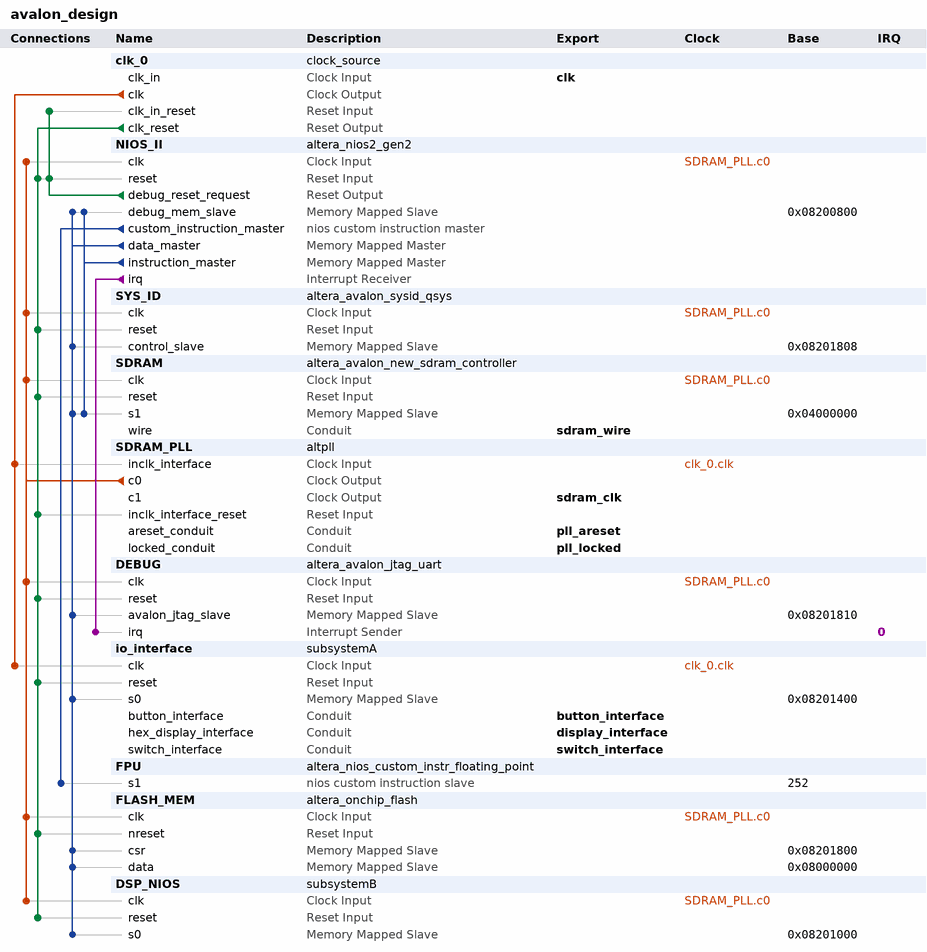
[diagram p0: system contents]
# Platform Designer (Qsys) system avalon_design, MAX 10 10M50DAF484C7G
# Parameters at their usual value, and those the tool derives, are not listed.
package require -exact qsys 18.1
create_system avalon_design
set_project_property DEVICE_FAMILY {MAX 10}
set_project_property DEVICE 10M50DAF484C7G

add_instance clk_0 clock_source 18.1
set_instance_parameter_value clk_0 clockFrequency 50000000

add_instance NIOS_II altera_nios2_gen2 18.1
set_instance_parameter_value NIOS_II dcache_size 2048
set_instance_parameter_value NIOS_II exceptionSlave SDRAM.s1
set_instance_parameter_value NIOS_II icache_size 4096
set_instance_parameter_value NIOS_II impl Fast
set_instance_parameter_value NIOS_II resetSlave SDRAM.s1

add_instance SYS_ID altera_avalon_sysid_qsys 18.1
set_instance_parameter_value SYS_ID id 0

add_instance SDRAM altera_avalon_new_sdram_controller 18.1
set_instance_parameter_value SDRAM TAC 5.5
set_instance_parameter_value SDRAM TRCD 20.0
set_instance_parameter_value SDRAM TRP 20.0
set_instance_parameter_value SDRAM casLatency 3
set_instance_parameter_value SDRAM columnWidth 10
set_instance_parameter_value SDRAM dataWidth 16
set_instance_parameter_value SDRAM generateSimulationModel false
set_instance_parameter_value SDRAM model single_Micron_MT48LC4M32B2_7_chip
set_instance_parameter_value SDRAM numberOfBanks 4
set_instance_parameter_value SDRAM numberOfChipSelects 1
set_instance_parameter_value SDRAM powerUpDelay 100.0
set_instance_parameter_value SDRAM refreshPeriod 15.625
set_instance_parameter_value SDRAM rowWidth 13

add_instance SDRAM_PLL altpll 18.1
set_instance_parameter_value SDRAM_PLL CLK0_DIVIDE_BY 1
set_instance_parameter_value SDRAM_PLL CLK0_MULTIPLY_BY 1
set_instance_parameter_value SDRAM_PLL CLK1_DIVIDE_BY 1
set_instance_parameter_value SDRAM_PLL CLK1_DUTY_CYCLE 50
set_instance_parameter_value SDRAM_PLL CLK1_MULTIPLY_BY 1
set_instance_parameter_value SDRAM_PLL CLK1_PHASE_SHIFT -3000
set_instance_parameter_value SDRAM_PLL INCLK0_INPUT_FREQUENCY 20000
set_instance_parameter_value SDRAM_PLL PORT_ARESET PORT_USED
set_instance_parameter_value SDRAM_PLL PORT_LOCKED PORT_USED
set_instance_parameter_value SDRAM_PLL PORT_clk1 PORT_USED
set_instance_parameter_value SDRAM_PLL PORT_clk2 PORT_UNUSED
set_instance_parameter_value SDRAM_PLL PORT_clk3 PORT_UNUSED

add_instance DEBUG altera_avalon_jtag_uart 18.1
set_instance_parameter_value DEBUG simInteractiveOptions NO_INTERACTIVE_WINDOWS

add_instance io_interface subsystemA 1.0

add_instance FPU altera_nios_custom_instr_floating_point 18.1
set_instance_parameter_value FPU useDivider 0

add_instance FLASH_MEM altera_onchip_flash 18.1
set_instance_parameter_value FLASH_MEM CLOCK_FREQUENCY 50.0
set_instance_parameter_value FLASH_MEM CONFIGURATION_MODE {Single Uncompressed Image with Memory Initialization}
set_instance_parameter_value FLASH_MEM SECTOR_ACCESS_MODE {Read and write,Read and write,Read and write,Read and write,Read and write}
set_instance_parameter_value FLASH_MEM initFlashContent false
set_instance_parameter_value FLASH_MEM initializationFileName altera_onchip_flash.hex
set_instance_parameter_value FLASH_MEM useNonDefaultInitFile false

add_instance DSP_NIOS subsystemB 1.0

# connections
add_connection clk_0.clk io_interface.clk clock
add_connection clk_0.clk SDRAM_PLL.inclk_interface clock
add_connection SDRAM_PLL.c0 DEBUG.clk clock
add_connection SDRAM_PLL.c0 DSP_NIOS.clk clock
add_connection SDRAM_PLL.c0 FLASH_MEM.clk clock
add_connection SDRAM_PLL.c0 NIOS_II.clk clock
add_connection SDRAM_PLL.c0 SDRAM.clk clock
add_connection SDRAM_PLL.c0 SYS_ID.clk clock
add_connection clk_0.clk_reset DEBUG.reset reset
add_connection clk_0.clk_reset DSP_NIOS.reset reset
add_connection clk_0.clk_reset FLASH_MEM.nreset reset
add_connection clk_0.clk_reset io_interface.reset reset
add_connection clk_0.clk_reset NIOS_II.reset reset
add_connection clk_0.clk_reset SDRAM.reset reset
add_connection clk_0.clk_reset SDRAM_PLL.inclk_interface_reset reset
add_connection clk_0.clk_reset SYS_ID.reset reset
add_connection NIOS_II.debug_reset_request clk_0.clk_in_reset reset
add_connection NIOS_II.debug_reset_request NIOS_II.reset reset
add_connection NIOS_II.data_master DEBUG.avalon_jtag_slave avalon
set_connection_parameter_value NIOS_II.data_master/DEBUG.avalon_jtag_slave baseAddress 0x08201810
add_connection NIOS_II.data_master DSP_NIOS.s0 avalon
set_connection_parameter_value NIOS_II.data_master/DSP_NIOS.s0 baseAddress 0x08201000
add_connection NIOS_II.data_master FLASH_MEM.csr avalon
set_connection_parameter_value NIOS_II.data_master/FLASH_MEM.csr baseAddress 0x08201800
add_connection NIOS_II.data_master FLASH_MEM.data avalon
set_connection_parameter_value NIOS_II.data_master/FLASH_MEM.data baseAddress 0x08000000
add_connection NIOS_II.data_master io_interface.s0 avalon
set_connection_parameter_value NIOS_II.data_master/io_interface.s0 baseAddress 0x08201400
add_connection NIOS_II.data_master NIOS_II.debug_mem_slave avalon
set_connection_parameter_value NIOS_II.data_master/NIOS_II.debug_mem_slave baseAddress 0x08200800
add_connection NIOS_II.data_master SDRAM.s1 avalon
set_connection_parameter_value NIOS_II.data_master/SDRAM.s1 baseAddress 0x04000000
add_connection NIOS_II.data_master SYS_ID.control_slave avalon
set_connection_parameter_value NIOS_II.data_master/SYS_ID.control_slave baseAddress 0x08201808
add_connection NIOS_II.instruction_master NIOS_II.debug_mem_slave avalon
set_connection_parameter_value NIOS_II.instruction_master/NIOS_II.debug_mem_slave baseAddress 0x08200800
add_connection NIOS_II.instruction_master SDRAM.s1 avalon
set_connection_parameter_value NIOS_II.instruction_master/SDRAM.s1 baseAddress 0x04000000
add_connection NIOS_II.irq DEBUG.irq interrupt
set_connection_parameter_value NIOS_II.irq/DEBUG.irq irqNumber 0
add_connection NIOS_II.custom_instruction_master FPU.s1 nios_custom_instruction
set_connection_parameter_value NIOS_II.custom_instruction_master/FPU.s1 CIName nios_custom_instr_floating_point_0
set_connection_parameter_value NIOS_II.custom_instruction_master/FPU.s1 baseAddress 252

# exported interfaces
add_interface button_interface conduit end
set_interface_property button_interface EXPORT_OF io_interface.button_interface
add_interface clk clock sink
set_interface_property clk EXPORT_OF clk_0.clk_in
add_interface display_interface conduit end
set_interface_property display_interface EXPORT_OF io_interface.hex_display_interface
add_interface pll_areset conduit end
set_interface_property pll_areset EXPORT_OF SDRAM_PLL.areset_conduit
add_interface pll_locked conduit end
set_interface_property pll_locked EXPORT_OF SDRAM_PLL.locked_conduit
add_interface sdram_clk clock source
set_interface_property sdram_clk EXPORT_OF SDRAM_PLL.c1
add_interface sdram_wire conduit end
set_interface_property sdram_wire EXPORT_OF SDRAM.wire
add_interface switch_interface conduit end
set_interface_property switch_interface EXPORT_OF io_interface.switch_interface

set_interconnect_requirement {$system} qsys_mm.clockCrossingAdapter HANDSHAKE
set_interconnect_requirement {$system} qsys_mm.enableEccProtection FALSE
set_interconnect_requirement {$system} qsys_mm.insertDefaultSlave FALSE
set_interconnect_requirement {$system} qsys_mm.maxAdditionalLatency 1

save_system avalon_design.qsys
